# Altium schematic sheet Scheme.SchDoc
size A3
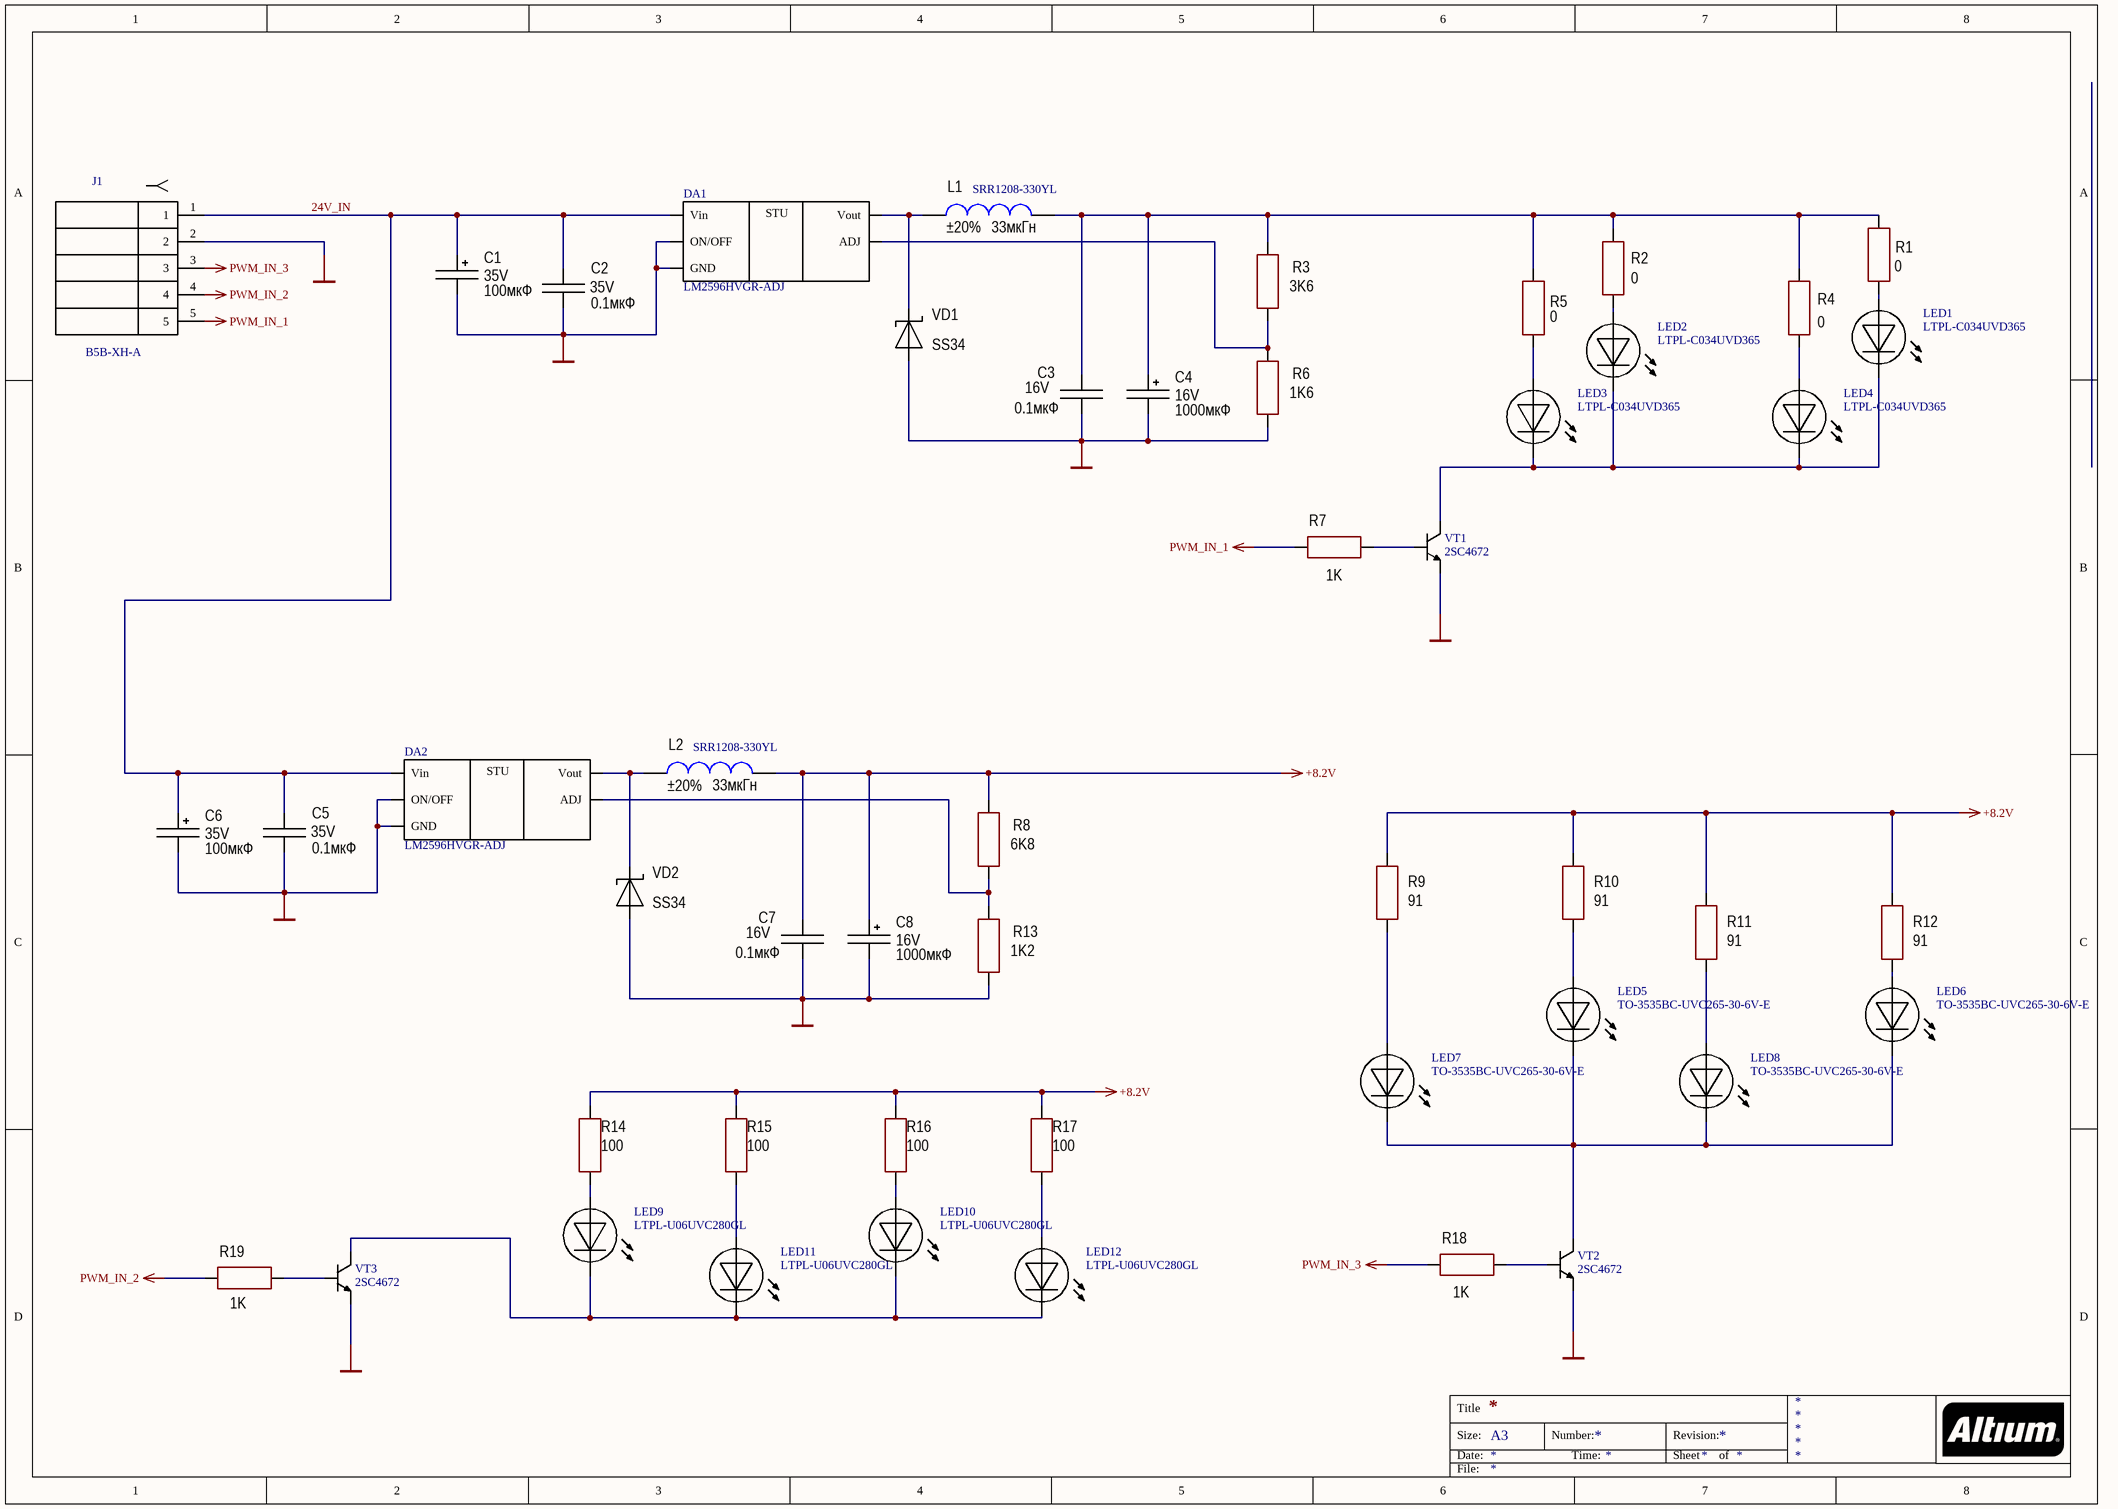
[diagram p0: Scheme.SchDoc]

## Parts
C1  value 100мкФ  Voltage: 35V  [CAP: D8C3.5H12]
C2  value 0.1мкФ  Voltage: 35V  [CAP: 0805]
C3  value 0.1мкФ  Voltage: 16V  [CAP: 0805]
C4  value 1000мкФ  Voltage: 16V  [CAP: D8C3.5H12]
C5  value 0.1мкФ  Voltage: 35V  [CAP: 0805]
C6  value 100мкФ  Voltage: 35V  [CAP: D8C3.5H12]
C7  value 0.1мкФ  Voltage: 16V  [CAP: 0805]
C8  value 1000мкФ  Voltage: 16V  [CAP: D8C3.5H12]
DA1  LM2596HVGR-ADJ  [to-263-5l]
DA2  LM2596HVGR-ADJ  [to-263-5l]
J1  B5B-XH-A  [B5B-XH-A]
L1  value 33мкГн  Tolerance: ±20%  [SRR1208-330YL]
L2  value 33мкГн  Tolerance: ±20%  [SRR1208-330YL]
LED1  LTPL-C034UVD365  [LTPL-C034UVD365]
LED2  LTPL-C034UVD365  [LTPL-C034UVD365]
LED3  LTPL-C034UVD365  [LTPL-C034UVD365]
LED4  LTPL-C034UVD365  [LTPL-C034UVD365]
LED5  TO-3535BC-UVC265-30-6V-E  [TO-3535BC-UVC265-30-6V-E]
LED6  TO-3535BC-UVC265-30-6V-E  [TO-3535BC-UVC265-30-6V-E]
LED7  TO-3535BC-UVC265-30-6V-E  [TO-3535BC-UVC265-30-6V-E]
LED8  TO-3535BC-UVC265-30-6V-E  [TO-3535BC-UVC265-30-6V-E]
LED9  LTPL-U06UVC280GL  [LTPL-U06UVC280GL]
LED10  LTPL-U06UVC280GL  [LTPL-U06UVC280GL]
LED11  LTPL-U06UVC280GL  [LTPL-U06UVC280GL]
LED12  LTPL-U06UVC280GL  [LTPL-U06UVC280GL]
R1  value 0  [RES: 0805]
R2  value 0  [RES: 0805]
R3  value 3K6  [RES: 0805]
R4  value 0  [RES: 0805]
R5  value 0  [RES: 0805]
R6  value 1K6  [RES: 0805]
R7  value 1K  [RES: 0805]
R8  value 6K8  [RES: 0805]
R9  value 91  [RES: 0805]
R10  value 91  [RES: 0805]
R11  value 91  [RES: 0805]
R12  value 91  [RES: 0805]
R13  value 1K2  [RES: 0805]
R14  value 100  [RES: 0805]
R15  value 100  [RES: 0805]
R16  value 100  [RES: 0805]
R17  value 100  [RES: 0805]
R18  value 1K  [RES: 0805]
R19  value 1K  [RES: 0805]
VD1  PartNumber: SS34  [DIODE: SMC]
VD2  PartNumber: SS34  [DIODE: SMC]
VT1  2SC4672  [2SC4672]
VT2  2SC4672  [2SC4672]
VT3  2SC4672  [2SC4672]

## Nets
+8.2V: C7.2 C8.1 L2.1 R8.2 R9.2 R10.2 R11.2 R12.2 R14.1 R15.1 R16.1 R17.1
GND: C1.2 C2.1 C3.1 C4.2 C5.1 C6.2 C7.1 C8.2 DA1.3(GND) DA1.5(ON/OFF) DA2.3(GND) DA2.5(ON/OFF) J1.2 R6.1 R13.1 VD1.1 VD2.1 VT1.1(E) VT2.1(E) VT3.1(E)
PWM_IN_1: J1.5 R7.1
PWM_IN_2: J1.4 R19.1
PWM_IN_3: J1.3 R18.1
24V_IN: C1.1 C2.2 C5.2 C6.1 DA1.1(Vin) DA2.1(Vin) J1.1
NetC3_2: C3.2 C4.1 L1.1 R1.2 R2.2 R3.2 R4.2 R5.2
NetDA1_2: DA1.2(Vout) L1.2 VD1.2
NetDA1_4: DA1.4(ADJ) R3.1 R6.2
NetDA2_2: DA2.2(Vout) L2.2 VD2.2
NetDA2_4: DA2.4(ADJ) R8.1 R13.2
NetLED1_1: LED1.1(A) R1.1
NetLED1_2: LED1.2(K) LED2.2(K) LED3.2(K) LED4.2(K) VT1.2(C)
NetLED2_1: LED2.1(A) R2.1
NetLED3_1: LED3.1(A) R5.1
NetLED4_1: LED4.1(A) R4.1
NetLED5_3: LED5.3(A) R10.1
NetLED5_4: LED5.4(K) LED6.4(K) LED7.4(K) LED8.4(K) VT2.2(C)
NetLED6_3: LED6.3(A) R12.1
NetLED7_3: LED7.3(A) R9.1
NetLED8_3: LED8.3(A) R11.1
NetLED9_1: LED9.1(A) R14.2
NetLED9_2: LED9.2(K) LED10.2(K) LED11.2(K) LED12.2(K) VT3.2(C)
NetLED10_1: LED10.1(A) R16.2
NetLED11_1: LED11.1(A) R15.2
NetLED12_1: LED12.1(A) R17.2
NetR7_2: R7.2 VT1.3(B)
NetR18_2: R18.2 VT2.3(B)
NetR19_2: R19.2 VT3.3(B)

## Notes on the sheet
- (near L1) SRR1208-330YL
- (near L2) SRR1208-330YL
- Title
- Size:
- Date:
- A3
- Number:
- Time:
- Revision:
- Sheet
- of
- File:
- (in symbol LM2596HVGR-ADJ) STU

## Library data of the parts
C1 C6 = Aluminium: Manufacturer: Wurth; PartNumber: 860080475013; ValueManufacturerPartNumber: Aluminium capacitor, 100мкФ, 35V, ±20%, 54mOhm, 14x10x5 mm, -55...+105°C; TypeCapacitor: Aluminium capacitor; Tolerance: ±20%; Impedance: 54mOhm; Package: 14x10x5 mm; HelpURL: https://www.digikey.com/product-detail/en/wurth-electronics-inc/860080475013/732-9029-1-ND/5728972; Temperature: -55...+105°C
C2 C5 = Ceramic_0805: Manufacturer: Yageo; PartNumber: CC0805KRX7R7BB104; ValueManufacturerPartNumber: Ceramic capacitor, 0.1мкФ, X7R, ±10%, 35V, 0805, -55...+125°C; TypeCapacitor: Ceramic capacitor; Tolerance: ±10%; TypeDielectric: X7R; Package: 0805; HelpURL: https://www.digikey.com/product-detail/en/yageo/CC0805KRX7R7BB104/311-1142-1-ND/303052; Temperature: -55...+125°C
C3 C7 = Ceramic_0805: Manufacturer: Yageo; PartNumber: CC0805KRX7R7BB104; ValueManufacturerPartNumber: Ceramic capacitor, 0.1мкФ, X7R, ±10%, 16V, 0805, -55...+125°C; TypeCapacitor: Ceramic capacitor; Tolerance: ±10%; TypeDielectric: X7R; Package: 0805; HelpURL: https://www.digikey.com/product-detail/en/yageo/CC0805KRX7R7BB104/311-1142-1-ND/303052; Temperature: -55...+125°C
C4 C8 = Aluminium: Manufacturer: Wurth; PartNumber: 860080475013; ValueManufacturerPartNumber: Aluminium capacitor, 1000мкФ, 16V, ±20%, 54mOhm, 14x10x5 mm, -55...+105°C; TypeCapacitor: Aluminium capacitor; Tolerance: ±20%; Impedance: 54mOhm; Package: 14x10x5 mm; HelpURL: https://www.digikey.com/product-detail/en/wurth-electronics-inc/860080475013/732-9029-1-ND/5728972; Temperature: -55...+105°C
DA1 DA2 = LM2596HVGR-ADJ: Step-down DC-DC, 3A
J1 = CONNECTOR_5PIN: Connector
L1 L2 = Inductor_0805: https://www.chipdip.ru/product/srr1208-330yl; Manufacturer: Murata Electronics; PartNumber: LQM21FN100M70L; ValueManufacturerPartNumber: Fixed inductor, 33мкГн, ±20%, 0805, 100mA, -55...+125°C; TypeInductor: Fixed inductor; MaxCurrent: 100mA; Package: 0805; HelpURL: https://www.digikey.com/product-detail/en/murata-electronics-north-america/LQM21FN100M70L/490-4029-1-ND/1016289; Temperature: -55...+125°C
LED1-LED4 = LTPL-C034UVD365: UF-LED, 350mA
LED5-LED8 = TO-3535BC-UVC265-30-6V-E: UV-LED, 30mA
LED9-LED12 = LTPL-U06UVC280GL: UF-LED, 20mA
R1 R2 R4 R5 = Resistor_0805: Manufacturer: Yageo; PartNumber: RC0805JR-07100RL; ValueManufacturerPartNumber: Resistor film, 0, ±5%, 0805, 0.125W, -55...+125°C; TypeResistor: Resistor film; Power: 0.125W; Tolerance: ±5%; Package: 0805; HelpURL: https://www.digikey.com/product-detail/en/yageo/RC0805JR-07100RL/311-100ARCT-ND/731185; Temperature: -55...+125°C
R3 = Resistor_0805: Manufacturer: Yageo; PartNumber: RC0805JR-07100RL; ValueManufacturerPartNumber: Resistor film, 3K6, ±5%, 0805, 0.125W, -55...+125°C; TypeResistor: Resistor film; Power: 0.125W; Tolerance: ±5%; Package: 0805; HelpURL: https://www.digikey.com/product-detail/en/yageo/RC0805JR-07100RL/311-100ARCT-ND/731185; Temperature: -55...+125°C
R6 = Resistor_0805: Manufacturer: Yageo; PartNumber: RC0805JR-07100RL; ValueManufacturerPartNumber: Resistor film, 1K6, ±5%, 0805, 0.125W, -55...+125°C; TypeResistor: Resistor film; Power: 0.125W; Tolerance: ±5%; Package: 0805; HelpURL: https://www.digikey.com/product-detail/en/yageo/RC0805JR-07100RL/311-100ARCT-ND/731185; Temperature: -55...+125°C
R7 R18 R19 = Resistor_0805: Manufacturer: Yageo; PartNumber: RC0805JR-07100RL; ValueManufacturerPartNumber: Resistor film, 1K, ±5%, 0805, 0.125W, -55...+125°C; TypeResistor: Resistor film; Power: 0.125W; Tolerance: ±5%; Package: 0805; HelpURL: https://www.digikey.com/product-detail/en/yageo/RC0805JR-07100RL/311-100ARCT-ND/731185; Temperature: -55...+125°C
R8 = Resistor_0805: Manufacturer: Yageo; PartNumber: RC0805JR-07100RL; ValueManufacturerPartNumber: Resistor film, 6K8, ±5%, 0805, 0.125W, -55...+125°C; TypeResistor: Resistor film; Power: 0.125W; Tolerance: ±5%; Package: 0805; HelpURL: https://www.digikey.com/product-detail/en/yageo/RC0805JR-07100RL/311-100ARCT-ND/731185; Temperature: -55...+125°C
R9-R12 = Resistor_0805: Manufacturer: Yageo; PartNumber: RC0805JR-07100RL; ValueManufacturerPartNumber: Resistor film, 91, ±5%, 0805, 0.125W, -55...+125°C; TypeResistor: Resistor film; Power: 0.125W; Tolerance: ±5%; Package: 0805; HelpURL: https://www.digikey.com/product-detail/en/yageo/RC0805JR-07100RL/311-100ARCT-ND/731185; Temperature: -55...+125°C
R13 = Resistor_0805: Manufacturer: Yageo; PartNumber: RC0805JR-07100RL; ValueManufacturerPartNumber: Resistor film, 1K2, ±5%, 0805, 0.125W, -55...+125°C; TypeResistor: Resistor film; Power: 0.125W; Tolerance: ±5%; Package: 0805; HelpURL: https://www.digikey.com/product-detail/en/yageo/RC0805JR-07100RL/311-100ARCT-ND/731185; Temperature: -55...+125°C
R14-R17 = Resistor_0805: Manufacturer: Yageo; PartNumber: RC0805JR-07100RL; ValueManufacturerPartNumber: Resistor film, 100, ±5%, 0805, 0.125W, -55...+125°C; TypeResistor: Resistor film; Power: 0.125W; Tolerance: ±5%; Package: 0805; HelpURL: https://www.digikey.com/product-detail/en/yageo/RC0805JR-07100RL/311-100ARCT-ND/731185; Temperature: -55...+125°C
VD1 VD2 = Schottky_single: https://www.chipdip.ru/product/srr1208-330yl; Manufacturer: Diodes Incorporated; ValueManufacturerPartNumber: Schottky diode, 80V, 500mA, 1V, 15pF, SOD-123, -55...+150°C; TypeDiode: Schottky diode; Voltage: 80V; Current: 500mA; VoltageDrop: 1V; RecoveryTime: 15pF; Package: SOD-123; HelpURL: https://www.digikey.com/product-detail/en/diodes-incorporated/MBR0580S1-7/MBR0580S1-7DICT-ND/5080371; Temperature: -55...+150°C